# Altium project ICSL Receiver kecil.PrjPCB
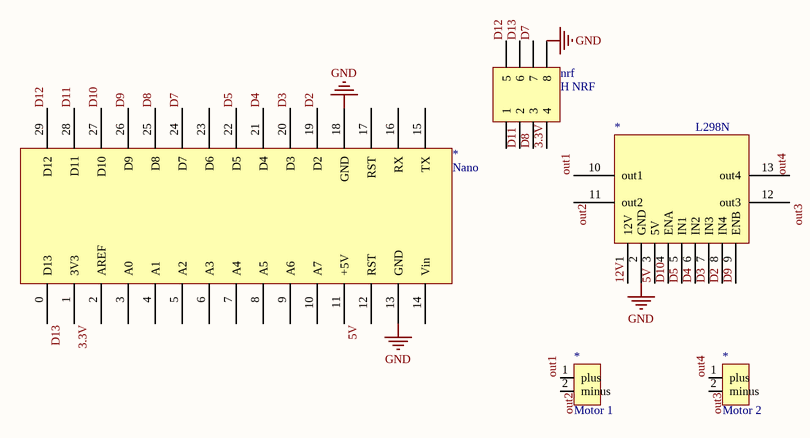
[diagram p0: ICSL Receiver kecil.SchDoc]
1 sheet, 5 parts. Net scope: global (net labels, ports and power ports of the same name join across sheets).
Board file: ICSL Receiver kecil.PcbDoc

## Sheet ICSL Receiver kecil.SchDoc
size A

### Parts
(Parts that share a designator on the sheet are numbered #1, #2 ... from top to bottom, then left to right.)
*#1  Nano  [ArduinoNano]
*#2  L298N  [PCBComponent_1]
*#3  Motor 1  [PCBComponent_1]
*#4  Motor 2  [PCBComponent_1]
nrf  H NRF  [HDR2X4_CEN]

### Nets
GND: *#1.13(GND) *#1.18(GND) *#2.2(GND) nrf.8
3.3V: *#1.1(3V3) nrf.4
5V: *#1.11(+5V) *#2.3(5V)
12V: *#2.1(12V)
D2: *#1.19(D2) *#2.8(IN4)
D3: *#1.20(D3) *#2.7(IN3)
D4: *#1.21(D4) *#2.6(IN2)
D5: *#1.22(D5) *#2.5(IN1)
D7: *#1.24(D7) nrf.7
D8: *#1.25(D8) nrf.3
D9: *#1.26(D9) *#2.9(ENB)
D10: *#1.27(D10) *#2.4(ENA)
D11: *#1.28(D11) nrf.2
D12: *#1.29(D12) nrf.5
D13: *#1.0(D13) nrf.6
out1: *#2.10(out1) *#3.1(plus)
out2: *#2.11(out2) *#3.2(minus)
out3: *#2.12(out3) *#4.2(minus)
out4: *#2.13(out4) *#4.1(plus)

Not connected (* = marked no-connect by the designer): *#1 2(AREF) 3(A0) 4(A1) 5(A2) 6(A3) 7(A4) 8(A5) 9(A6) 10(A7) 12(RST) 14(Vin) 15(TX) 16(RX) 17(RST) 23(D6); nrf 1

### Library data of the parts
*#1-*#4 = Component_1
nrf = Header 4X2A: Header, 4-Pin, Dual row; LatestRevisionDate: 17-Jul-2002; LatestRevisionNote: Re-released for DXP Platform.; Publisher: Altium Limited